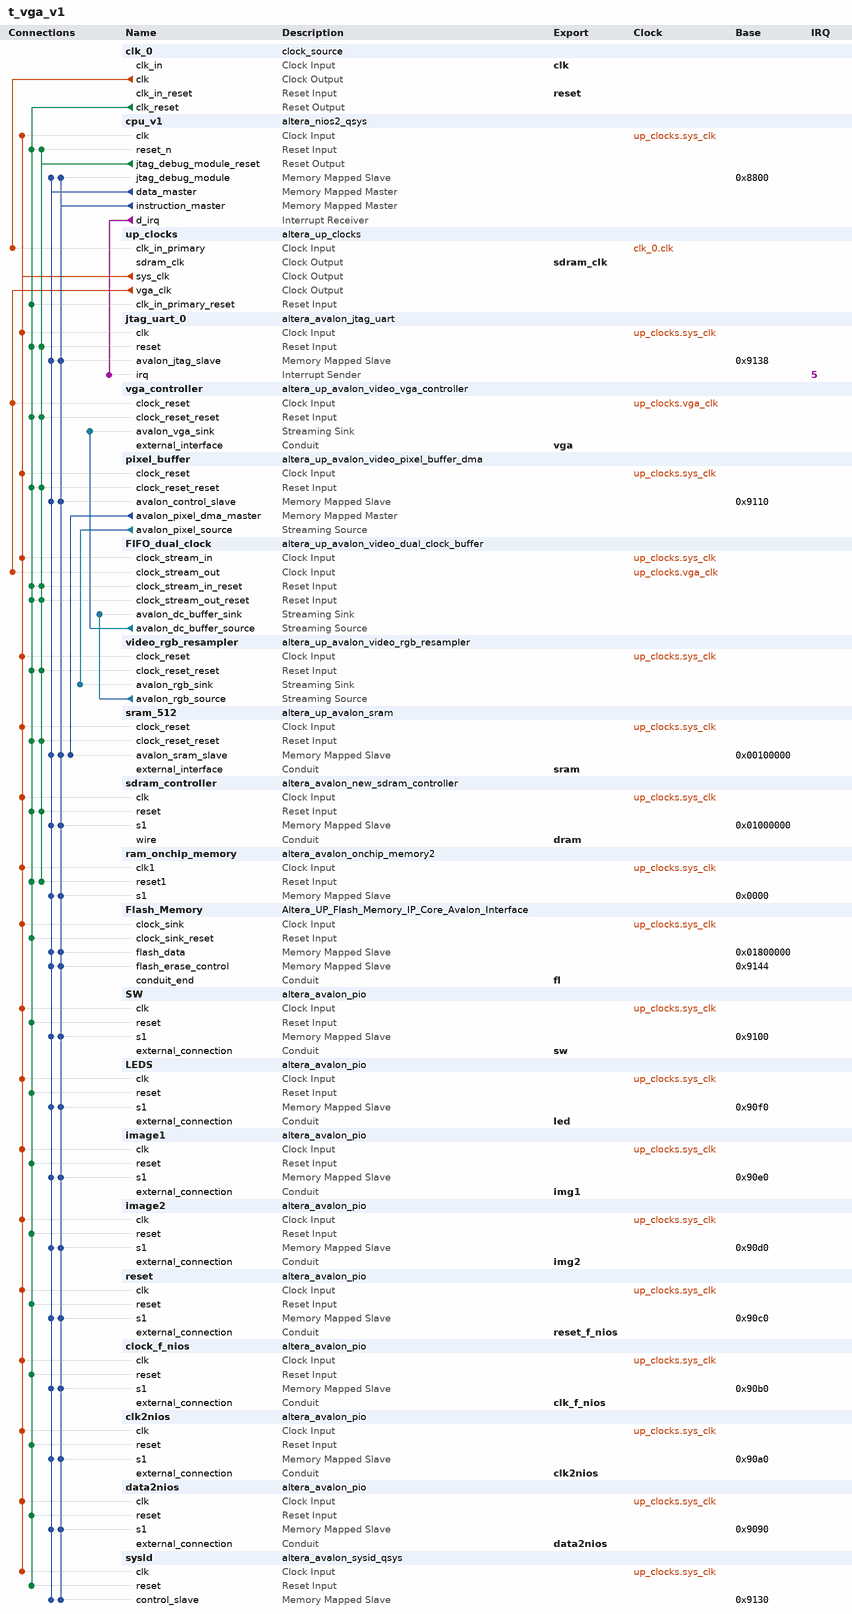
[diagram p0: system contents]
# Platform Designer (Qsys) system t_vga_v1, Cyclone II EP2C20F484C7
# Parameters at their usual value, and those the tool derives, are not listed.
package require -exact qsys 13.0.1.99.2
create_system t_vga_v1
set_project_property DEVICE_FAMILY {Cyclone II}
set_project_property DEVICE EP2C20F484C7

add_instance clk_0 clock_source 13.0
set_instance_parameter_value clk_0 clockFrequency 50000000

add_instance cpu_v1 altera_nios2_qsys 13.0
set_instance_parameter_value cpu_v1 resetSlave ram_onchip_memory.s1
set_instance_parameter_value cpu_v1 mmu_TLBMissExcSlave None
set_instance_parameter_value cpu_v1 exceptionSlave ram_onchip_memory.s1
set_instance_parameter_value cpu_v1 breakSlave cpu_v1.jtag_debug_module
set_instance_parameter_value cpu_v1 impl Tiny
set_instance_parameter_value cpu_v1 icache_size 4096

add_instance up_clocks altera_up_clocks 13.0
set_instance_parameter_value up_clocks board DE1
set_instance_parameter_value up_clocks vga_clk true
set_instance_parameter_value up_clocks audio_clk false
set_instance_parameter_value up_clocks audio_clk_freq 12.288

add_instance jtag_uart_0 altera_avalon_jtag_uart 13.0.1.99.2
set_instance_parameter_value jtag_uart_0 simInteractiveOptions NO_INTERACTIVE_WINDOWS

add_instance vga_controller altera_up_avalon_video_vga_controller 13.0
set_instance_parameter_value vga_controller board DE1

add_instance pixel_buffer altera_up_avalon_video_pixel_buffer_dma 13.0
set_instance_parameter_value pixel_buffer addr_mode Consecutive
set_instance_parameter_value pixel_buffer start_address 16777216
set_instance_parameter_value pixel_buffer back_start_address 16777216
set_instance_parameter_value pixel_buffer image_width 640
set_instance_parameter_value pixel_buffer image_height 480
set_instance_parameter_value pixel_buffer color_space {8-bit Grayscale}

add_instance FIFO_dual_clock altera_up_avalon_video_dual_clock_buffer 13.0
set_instance_parameter_value FIFO_dual_clock color_bits 10

add_instance video_rgb_resampler altera_up_avalon_video_rgb_resampler 13.0
set_instance_parameter_value video_rgb_resampler input_type {8-bit Grayscale}
set_instance_parameter_value video_rgb_resampler output_type {30-bit RGB}
set_instance_parameter_value video_rgb_resampler alpha 1023

add_instance sram_512 altera_up_avalon_sram 13.0
set_instance_parameter_value sram_512 board DE1
set_instance_parameter_value sram_512 pixel_buffer true

add_instance sdram_controller altera_avalon_new_sdram_controller 13.0.1.99.2
set_instance_parameter_value sdram_controller TAC 6.0
set_instance_parameter_value sdram_controller TRCD 20.0
set_instance_parameter_value sdram_controller TRP 20.0
set_instance_parameter_value sdram_controller casLatency 3
set_instance_parameter_value sdram_controller columnWidth 8
set_instance_parameter_value sdram_controller dataWidth 16
set_instance_parameter_value sdram_controller generateSimulationModel false
set_instance_parameter_value sdram_controller initRefreshCommands 8
set_instance_parameter_value sdram_controller model single_Micron_MT48LC4M32B2_7_chip
set_instance_parameter_value sdram_controller numberOfBanks 4
set_instance_parameter_value sdram_controller numberOfChipSelects 1
set_instance_parameter_value sdram_controller powerUpDelay 200.0
set_instance_parameter_value sdram_controller refreshPeriod 15.625
set_instance_parameter_value sdram_controller rowWidth 12

add_instance ram_onchip_memory altera_avalon_onchip_memory2 13.0.1.99.2
set_instance_parameter_value ram_onchip_memory dataWidth 32
set_instance_parameter_value ram_onchip_memory dualPort false
set_instance_parameter_value ram_onchip_memory initMemContent true
set_instance_parameter_value ram_onchip_memory initializationFileName onchip_mem.hex
set_instance_parameter_value ram_onchip_memory memorySize 20480

add_instance Flash_Memory Altera_UP_Flash_Memory_IP_Core_Avalon_Interface 13.0
set_instance_parameter_value Flash_Memory FLASH_MEMORY_ADDRESS_WIDTH 22

add_instance SW altera_avalon_pio 13.0.1.99.2
set_instance_parameter_value SW direction Input
set_instance_parameter_value SW width 3

add_instance LEDS altera_avalon_pio 13.0.1.99.2
set_instance_parameter_value LEDS direction Output
set_instance_parameter_value LEDS width 4

add_instance image1 altera_avalon_pio 13.0.1.99.2
set_instance_parameter_value image1 direction Output
set_instance_parameter_value image1 width 8

add_instance image2 altera_avalon_pio 13.0.1.99.2
set_instance_parameter_value image2 direction Output
set_instance_parameter_value image2 width 8

add_instance reset altera_avalon_pio 13.0.1.99.2
set_instance_parameter_value reset direction Output
set_instance_parameter_value reset width 1

add_instance clock_f_nios altera_avalon_pio 13.0.1.99.2
set_instance_parameter_value clock_f_nios direction Output
set_instance_parameter_value clock_f_nios width 1

add_instance clk2nios altera_avalon_pio 13.0.1.99.2
set_instance_parameter_value clk2nios direction Input
set_instance_parameter_value clk2nios width 1

add_instance data2nios altera_avalon_pio 13.0.1.99.2
set_instance_parameter_value data2nios direction Input
set_instance_parameter_value data2nios width 16

add_instance sysid altera_avalon_sysid_qsys 13.0
set_instance_parameter_value sysid id 0

# connections
add_connection clk_0.clk up_clocks.clk_in_primary clock
add_connection up_clocks.sys_clk clk2nios.clk clock
add_connection up_clocks.sys_clk clock_f_nios.clk clock
add_connection up_clocks.sys_clk cpu_v1.clk clock
add_connection up_clocks.sys_clk data2nios.clk clock
add_connection up_clocks.sys_clk FIFO_dual_clock.clock_stream_in clock
add_connection up_clocks.sys_clk Flash_Memory.clock_sink clock
add_connection up_clocks.sys_clk image1.clk clock
add_connection up_clocks.sys_clk image2.clk clock
add_connection up_clocks.sys_clk jtag_uart_0.clk clock
add_connection up_clocks.sys_clk LEDS.clk clock
add_connection up_clocks.sys_clk pixel_buffer.clock_reset clock
add_connection up_clocks.sys_clk ram_onchip_memory.clk1 clock
add_connection up_clocks.sys_clk reset.clk clock
add_connection up_clocks.sys_clk sdram_controller.clk clock
add_connection up_clocks.sys_clk sram_512.clock_reset clock
add_connection up_clocks.sys_clk SW.clk clock
add_connection up_clocks.sys_clk sysid.clk clock
add_connection up_clocks.sys_clk video_rgb_resampler.clock_reset clock
add_connection up_clocks.vga_clk FIFO_dual_clock.clock_stream_out clock
add_connection up_clocks.vga_clk vga_controller.clock_reset clock
add_connection clk_0.clk_reset clk2nios.reset reset
add_connection clk_0.clk_reset clock_f_nios.reset reset
add_connection clk_0.clk_reset cpu_v1.reset_n reset
add_connection clk_0.clk_reset data2nios.reset reset
add_connection clk_0.clk_reset FIFO_dual_clock.clock_stream_in_reset reset
add_connection clk_0.clk_reset FIFO_dual_clock.clock_stream_out_reset reset
add_connection clk_0.clk_reset Flash_Memory.clock_sink_reset reset
add_connection clk_0.clk_reset image1.reset reset
add_connection clk_0.clk_reset image2.reset reset
add_connection clk_0.clk_reset jtag_uart_0.reset reset
add_connection clk_0.clk_reset LEDS.reset reset
add_connection clk_0.clk_reset pixel_buffer.clock_reset_reset reset
add_connection clk_0.clk_reset ram_onchip_memory.reset1 reset
add_connection clk_0.clk_reset reset.reset reset
add_connection clk_0.clk_reset sdram_controller.reset reset
add_connection clk_0.clk_reset sram_512.clock_reset_reset reset
add_connection clk_0.clk_reset SW.reset reset
add_connection clk_0.clk_reset sysid.reset reset
add_connection clk_0.clk_reset up_clocks.clk_in_primary_reset reset
add_connection clk_0.clk_reset vga_controller.clock_reset_reset reset
add_connection clk_0.clk_reset video_rgb_resampler.clock_reset_reset reset
add_connection cpu_v1.jtag_debug_module_reset cpu_v1.reset_n reset
add_connection cpu_v1.jtag_debug_module_reset FIFO_dual_clock.clock_stream_in_reset reset
add_connection cpu_v1.jtag_debug_module_reset FIFO_dual_clock.clock_stream_out_reset reset
add_connection cpu_v1.jtag_debug_module_reset jtag_uart_0.reset reset
add_connection cpu_v1.jtag_debug_module_reset pixel_buffer.clock_reset_reset reset
add_connection cpu_v1.jtag_debug_module_reset ram_onchip_memory.reset1 reset
add_connection cpu_v1.jtag_debug_module_reset sdram_controller.reset reset
add_connection cpu_v1.jtag_debug_module_reset sram_512.clock_reset_reset reset
add_connection cpu_v1.jtag_debug_module_reset vga_controller.clock_reset_reset reset
add_connection cpu_v1.jtag_debug_module_reset video_rgb_resampler.clock_reset_reset reset
add_connection cpu_v1.data_master clk2nios.s1 avalon
set_connection_parameter_value cpu_v1.data_master/clk2nios.s1 baseAddress 0x90a0
add_connection cpu_v1.data_master clock_f_nios.s1 avalon
set_connection_parameter_value cpu_v1.data_master/clock_f_nios.s1 baseAddress 0x90b0
add_connection cpu_v1.data_master cpu_v1.jtag_debug_module avalon
set_connection_parameter_value cpu_v1.data_master/cpu_v1.jtag_debug_module baseAddress 0x8800
add_connection cpu_v1.data_master data2nios.s1 avalon
set_connection_parameter_value cpu_v1.data_master/data2nios.s1 baseAddress 0x9090
add_connection cpu_v1.data_master Flash_Memory.flash_data avalon
set_connection_parameter_value cpu_v1.data_master/Flash_Memory.flash_data baseAddress 0x01800000
add_connection cpu_v1.data_master Flash_Memory.flash_erase_control avalon
set_connection_parameter_value cpu_v1.data_master/Flash_Memory.flash_erase_control baseAddress 0x9144
add_connection cpu_v1.data_master image1.s1 avalon
set_connection_parameter_value cpu_v1.data_master/image1.s1 baseAddress 0x90e0
add_connection cpu_v1.data_master image2.s1 avalon
set_connection_parameter_value cpu_v1.data_master/image2.s1 baseAddress 0x90d0
add_connection cpu_v1.data_master jtag_uart_0.avalon_jtag_slave avalon
set_connection_parameter_value cpu_v1.data_master/jtag_uart_0.avalon_jtag_slave baseAddress 0x9138
add_connection cpu_v1.data_master LEDS.s1 avalon
set_connection_parameter_value cpu_v1.data_master/LEDS.s1 baseAddress 0x90f0
add_connection cpu_v1.data_master pixel_buffer.avalon_control_slave avalon
set_connection_parameter_value cpu_v1.data_master/pixel_buffer.avalon_control_slave baseAddress 0x9110
add_connection cpu_v1.data_master ram_onchip_memory.s1 avalon
set_connection_parameter_value cpu_v1.data_master/ram_onchip_memory.s1 baseAddress 0x0000
add_connection cpu_v1.data_master reset.s1 avalon
set_connection_parameter_value cpu_v1.data_master/reset.s1 baseAddress 0x90c0
add_connection cpu_v1.data_master sdram_controller.s1 avalon
set_connection_parameter_value cpu_v1.data_master/sdram_controller.s1 baseAddress 0x01000000
add_connection cpu_v1.data_master sram_512.avalon_sram_slave avalon
set_connection_parameter_value cpu_v1.data_master/sram_512.avalon_sram_slave baseAddress 0x00100000
add_connection cpu_v1.data_master SW.s1 avalon
set_connection_parameter_value cpu_v1.data_master/SW.s1 baseAddress 0x9100
add_connection cpu_v1.data_master sysid.control_slave avalon
set_connection_parameter_value cpu_v1.data_master/sysid.control_slave baseAddress 0x9130
add_connection cpu_v1.instruction_master clk2nios.s1 avalon
set_connection_parameter_value cpu_v1.instruction_master/clk2nios.s1 baseAddress 0x90a0
add_connection cpu_v1.instruction_master clock_f_nios.s1 avalon
set_connection_parameter_value cpu_v1.instruction_master/clock_f_nios.s1 baseAddress 0x90b0
add_connection cpu_v1.instruction_master cpu_v1.jtag_debug_module avalon
set_connection_parameter_value cpu_v1.instruction_master/cpu_v1.jtag_debug_module baseAddress 0x8800
add_connection cpu_v1.instruction_master data2nios.s1 avalon
set_connection_parameter_value cpu_v1.instruction_master/data2nios.s1 baseAddress 0x9090
add_connection cpu_v1.instruction_master Flash_Memory.flash_data avalon
set_connection_parameter_value cpu_v1.instruction_master/Flash_Memory.flash_data baseAddress 0x01800000
add_connection cpu_v1.instruction_master Flash_Memory.flash_erase_control avalon
set_connection_parameter_value cpu_v1.instruction_master/Flash_Memory.flash_erase_control baseAddress 0x9144
add_connection cpu_v1.instruction_master image1.s1 avalon
set_connection_parameter_value cpu_v1.instruction_master/image1.s1 baseAddress 0x90e0
add_connection cpu_v1.instruction_master image2.s1 avalon
set_connection_parameter_value cpu_v1.instruction_master/image2.s1 baseAddress 0x90d0
add_connection cpu_v1.instruction_master jtag_uart_0.avalon_jtag_slave avalon
set_connection_parameter_value cpu_v1.instruction_master/jtag_uart_0.avalon_jtag_slave baseAddress 0x9138
add_connection cpu_v1.instruction_master LEDS.s1 avalon
set_connection_parameter_value cpu_v1.instruction_master/LEDS.s1 baseAddress 0x90f0
add_connection cpu_v1.instruction_master pixel_buffer.avalon_control_slave avalon
set_connection_parameter_value cpu_v1.instruction_master/pixel_buffer.avalon_control_slave baseAddress 0x9110
add_connection cpu_v1.instruction_master ram_onchip_memory.s1 avalon
set_connection_parameter_value cpu_v1.instruction_master/ram_onchip_memory.s1 baseAddress 0x0000
add_connection cpu_v1.instruction_master reset.s1 avalon
set_connection_parameter_value cpu_v1.instruction_master/reset.s1 baseAddress 0x90c0
add_connection cpu_v1.instruction_master sdram_controller.s1 avalon
set_connection_parameter_value cpu_v1.instruction_master/sdram_controller.s1 baseAddress 0x01000000
add_connection cpu_v1.instruction_master sram_512.avalon_sram_slave avalon
set_connection_parameter_value cpu_v1.instruction_master/sram_512.avalon_sram_slave baseAddress 0x00100000
add_connection cpu_v1.instruction_master SW.s1 avalon
set_connection_parameter_value cpu_v1.instruction_master/SW.s1 baseAddress 0x9100
add_connection cpu_v1.instruction_master sysid.control_slave avalon
set_connection_parameter_value cpu_v1.instruction_master/sysid.control_slave baseAddress 0x9130
add_connection pixel_buffer.avalon_pixel_dma_master sram_512.avalon_sram_slave avalon
set_connection_parameter_value pixel_buffer.avalon_pixel_dma_master/sram_512.avalon_sram_slave baseAddress 0x00100000
add_connection FIFO_dual_clock.avalon_dc_buffer_source vga_controller.avalon_vga_sink avalon_streaming
add_connection pixel_buffer.avalon_pixel_source video_rgb_resampler.avalon_rgb_sink avalon_streaming
add_connection video_rgb_resampler.avalon_rgb_source FIFO_dual_clock.avalon_dc_buffer_sink avalon_streaming
add_connection cpu_v1.d_irq jtag_uart_0.irq interrupt
set_connection_parameter_value cpu_v1.d_irq/jtag_uart_0.irq irqNumber 5

# exported interfaces
add_interface clk clock sink
set_interface_property clk EXPORT_OF clk_0.clk_in
add_interface reset reset sink
set_interface_property reset EXPORT_OF clk_0.clk_in_reset
add_interface vga conduit end
set_interface_property vga EXPORT_OF vga_controller.external_interface
add_interface sdram_clk clock source
set_interface_property sdram_clk EXPORT_OF up_clocks.sdram_clk
add_interface sram conduit end
set_interface_property sram EXPORT_OF sram_512.external_interface
add_interface dram conduit end
set_interface_property dram EXPORT_OF sdram_controller.wire
add_interface fl conduit end
set_interface_property fl EXPORT_OF Flash_Memory.conduit_end
add_interface sw conduit end
set_interface_property sw EXPORT_OF SW.external_connection
add_interface led conduit end
set_interface_property led EXPORT_OF LEDS.external_connection
add_interface img1 conduit end
set_interface_property img1 EXPORT_OF image1.external_connection
add_interface img2 conduit end
set_interface_property img2 EXPORT_OF image2.external_connection
add_interface reset_f_nios conduit end
set_interface_property reset_f_nios EXPORT_OF reset.external_connection
add_interface clk_f_nios conduit end
set_interface_property clk_f_nios EXPORT_OF clock_f_nios.external_connection
add_interface clk2nios conduit end
set_interface_property clk2nios EXPORT_OF clk2nios.external_connection
add_interface data2nios conduit end
set_interface_property data2nios EXPORT_OF data2nios.external_connection

set_interconnect_requirement {$system} qsys_mm.clockCrossingAdapter HANDSHAKE
set_interconnect_requirement {$system} qsys_mm.maxAdditionalLatency 1

save_system t_vga_v1.qsys
